# Altium project Adapter_NI_IP_L1.PrjPCB
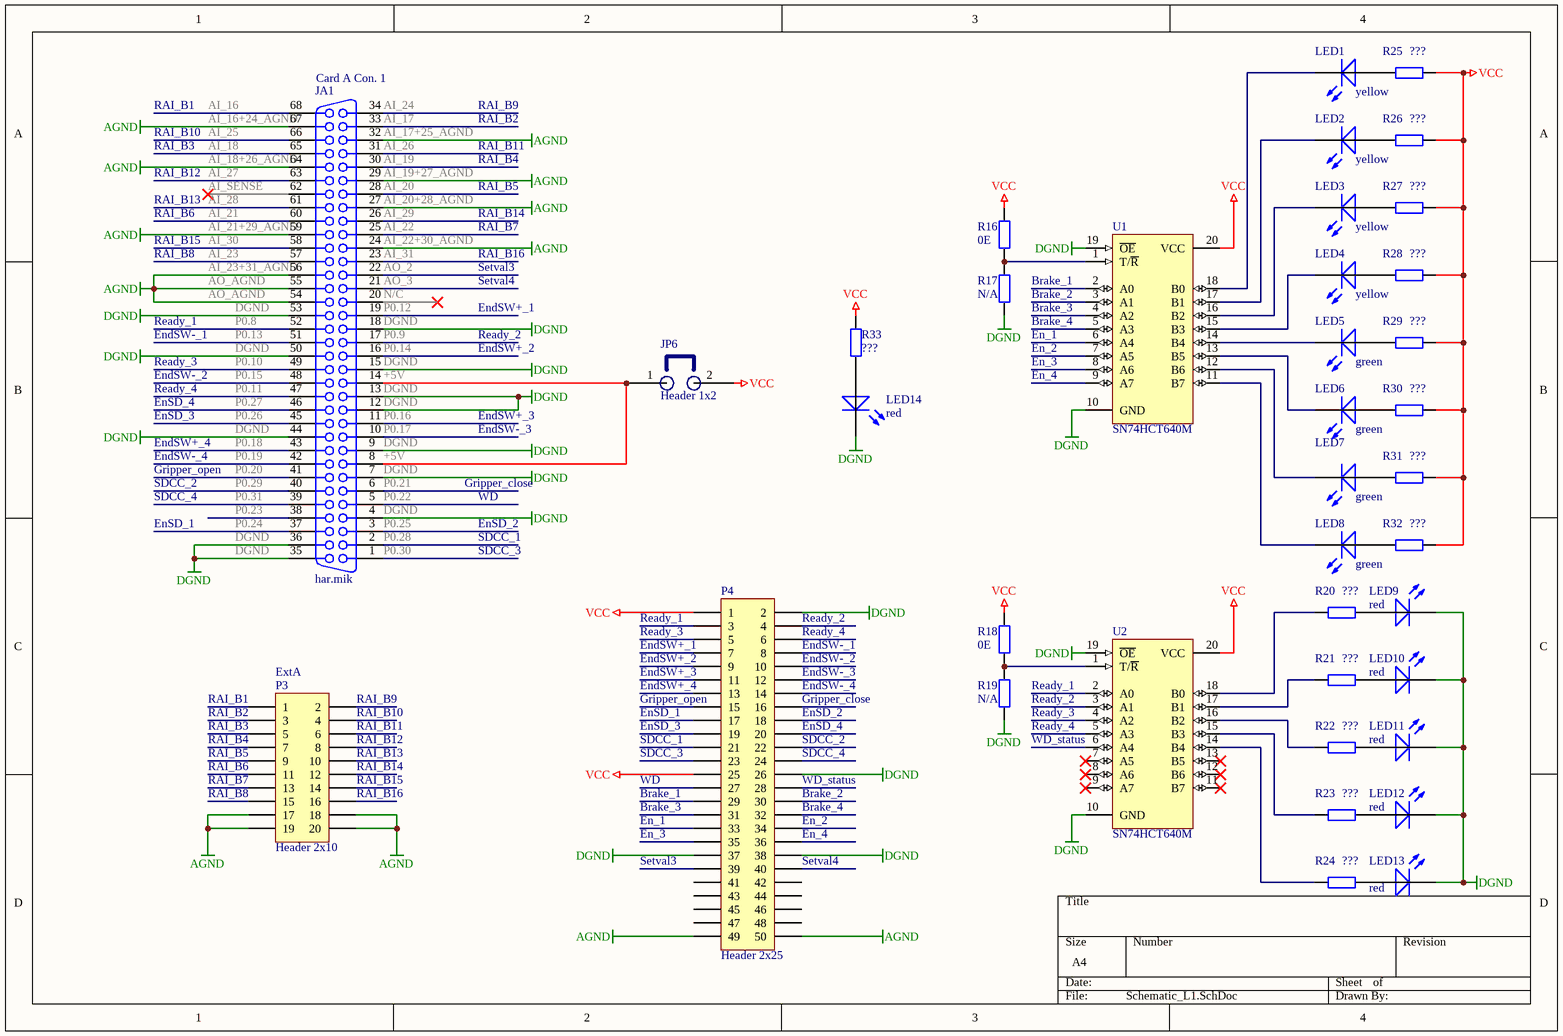
[diagram p0: Schematic_L1.SchDoc]
1 sheet, 38 parts. Net scope: global (net labels, ports and power ports of the same name join across sheets).
Board file: PCB_L1.PcbDoc

## Sheet Schematic_L1.SchDoc
size A4

### Parts
JA1  har.mik  [HAR-MIK P/S 68 SA]
JP6  Header 1x2  [Header - 1x2 - V]
LED1  yellow  [KM2520]
LED2  yellow  [KM2520]
LED3  yellow  [KM2520]
LED4  yellow  [KM2520]
LED5  green  [KM2520]
LED6  green  [KM2520]
LED7  green  [KM2520]
LED8  green  [KM2520]
LED9  red  [KM2520]
LED10  red  [KM2520]
LED11  red  [KM2520]
LED12  red  [KM2520]
LED13  red  [KM2520]
LED14  red  [KM2520]
P3  Header 2x10  [Header - 2x10 - V]
P4  Header 2x25  [Header - 2x25 - V]
R16  0E  [0805]
R17  N/A  [0805]
R18  0E  [0805]
R19  N/A  [0805]
R20  ???  [0805]
R21  ???  [0805]
R22  ???  [0805]
R23  ???  [0805]
R24  ???  [0805]
R25  ???  [0805]
R26  ???  [0805]
R27  ???  [0805]
R28  ???  [0805]
R29  ???  [0805]
R30  ???  [0805]
R31  ???  [0805]
R32  ???  [0805]
R33  ???  [0805]
U1  SN74HCT640M  [DW020_N]
U2  SN74HCT640M  [DW020_N]

### Nets
AGND: JA1.24 JA1.27 JA1.29 JA1.32 JA1.54 JA1.55 JA1.56 JA1.59 JA1.64 JA1.67 P3.17 P3.18 P3.19 P3.20 P4.49 P4.50
DGND: JA1.4 JA1.7 JA1.9 JA1.12 JA1.13 JA1.15 JA1.18 JA1.35 JA1.36 JA1.44 JA1.50 JA1.53 LED9.1(K) LED10.1(K) LED11.1(K) LED12.1(K) LED13.1(K) LED14.1(K) P4.2 P4.26 P4.37 P4.38 R17.1 R19.1 U1.10(GND) U1.19(~{OE}) U2.10(GND) U2.19(~{OE})
VCC: JP6.2 P4.1 P4.25 R16.2 R18.2 R25.2 R26.2 R27.2 R28.2 R29.2 R30.2 R31.2 R32.2 R33.2 U1.20(VCC) U2.20(VCC)
Brake_1: P4.29 U1.2(A0)
Brake_2: P4.30 U1.3(A1)
Brake_3: P4.31 U1.4(A2)
Brake_4: P4.32 U1.5(A3)
En_1: P4.33 U1.6(A4)
En_2: P4.34 U1.7(A5)
En_3: P4.35 U1.8(A6)
En_4: P4.36 U1.9(A7)
EndSW+_1: JA1.19 P4.7
EndSW+_2: JA1.16 P4.9
EndSW+_3: JA1.11 P4.11
EndSW+_4: JA1.43 P4.13
EndSW-_1: JA1.51 P4.8
EndSW-_2: JA1.48 P4.10
EndSW-_3: JA1.10 P4.12
EndSW-_4: JA1.42 P4.14
EnSD_1: JA1.37 P4.17
EnSD_2: JA1.3 P4.18
EnSD_3: JA1.45 P4.19
EnSD_4: JA1.46 P4.20
Gripper_close: JA1.6 P4.16
Gripper_open: JA1.41 P4.15
RAI_B1: JA1.68 P3.1
RAI_B2: JA1.33 P3.3
RAI_B3: JA1.65 P3.5
RAI_B4: JA1.30 P3.7
RAI_B5: JA1.28 P3.9
RAI_B6: JA1.60 P3.11
RAI_B7: JA1.25 P3.13
RAI_B8: JA1.57 P3.15
RAI_B9: JA1.34 P3.2
RAI_B10: JA1.66 P3.4
RAI_B11: JA1.31 P3.6
RAI_B12: JA1.63 P3.8
RAI_B13: JA1.61 P3.10
RAI_B14: JA1.26 P3.12
RAI_B15: JA1.58 P3.14
RAI_B16: JA1.23 P3.16
Ready_1: JA1.52 P4.3 U2.2(A0)
Ready_2: JA1.17 P4.4 U2.3(A1)
Ready_3: JA1.49 P4.5 U2.4(A2)
Ready_4: JA1.47 P4.6 U2.5(A3)
SDCC_1: JA1.2 P4.21
SDCC_2: JA1.40 P4.22
SDCC_3: JA1.1 P4.23
SDCC_4: JA1.39 P4.24
Setval3: JA1.22 P4.39
Setval4: JA1.21 P4.40
WD: JA1.5 P4.27
WD_status: P4.28 U2.6(A4)
NetJA1_8: JA1.8 JA1.14 JP6.1
NetLED1_1: LED1.1(K) U1.18(B0)
NetLED1_2: LED1.2(A) R25.1
NetLED2_1: LED2.1(K) U1.17(B1)
NetLED2_2: LED2.2(A) R26.1
NetLED3_1: LED3.1(K) U1.16(B2)
NetLED3_2: LED3.2(A) R27.1
NetLED4_1: LED4.1(K) U1.15(B3)
NetLED4_2: LED4.2(A) R28.1
NetLED5_1: LED5.1(K) U1.14(B4)
NetLED5_2: LED5.2(A) R29.1
NetLED6_1: LED6.1(K) U1.13(B5)
NetLED6_2: LED6.2(A) R30.1
NetLED7_1: LED7.1(K) U1.12(B6)
NetLED7_2: LED7.2(A) R31.1
NetLED8_1: LED8.1(K) U1.11(B7)
NetLED8_2: LED8.2(A) R32.1
NetLED9_2: LED9.2(A) R20.2
NetLED10_2: LED10.2(A) R21.2
NetLED11_2: LED11.2(A) R22.2
NetLED12_2: LED12.2(A) R23.2
NetLED13_2: LED13.2(A) R24.2
NetLED14_2: LED14.2(A) R33.1
NetR16_1: R16.1 R17.2 U1.1(T/~{R})
NetR18_1: R18.1 R19.2 U2.1(T/~{R})
NetR20_1: R20.1 U2.18(B0)
NetR21_1: R21.1 U2.17(B1)
NetR22_1: R22.1 U2.16(B2)
NetR23_1: R23.1 U2.15(B3)
NetR24_1: R24.1 U2.14(B4)

Not connected (* = marked no-connect by the designer): JA1 20* 38 62*; P4 41 42 43 44 45 46 47 48; U2 7(A5)* 8(A6)* 9(A7)* 11(B7)* 12(B6)* 13(B5)*

### Notes on the sheet
- AI_16
- (near JA1) Card A Con. 1
- (near JA1) AI_24
- AI_25
- AI_18
- AI_27
- (near JA1) AI_18+26_AGND
- (near JA1) AI_16+24_AGND
- (near JA1) AI_17
- (near JA1) AI_17+25_AGND
- (near JA1) AI_26
- (near JA1) AI_19
- (near JA1) AI_19+27_AGND
- AI_SENSE
- AI_28
- AI_21
- AI_30
- (near JA1) AI_21+29_AGND
- (near JA1) AI_20
- (near JA1) AI_20+28_AGND
- (near JA1) AI_29
- (near JA1) AI_22
- (near JA1) AI_22+30_AGND
- AI_23
- AO_AGND
- (near JA1) AI_23+31_AGND
- DGND
- (near JA1) N/C
- (near JA1) AI_31
- (near JA1) AO_2
- (near JA1) AO_3
- (near JA1) P0.12
- P0.8
- (near JA1) P0.13
- (near JA1) P0.10
- (near JA1) P0.15
- (near JA1) DGND
- (near JA1) P0.9
- (near JA1) P0.14
- (near JA1) +5V
- (near JA1) P0.11
- (near JA1) P0.27
- (near JA1) P0.26
- (near JA1) P0.18
- (near JA1) P0.16
- (near JA1) P0.17
- (near JA1) P0.19
- (near JA1) P0.20
- (near JA1) P0.29
- (near JA1) P0.31
- (near JA1) P0.23
- (near JA1) P0.21
- (near JA1) P0.22
- (near JA1) P0.24
- (near JA1) P0.25
- (near JA1) P0.28
- (near JA1) P0.30
- (near P3) ExtA

### Library data of the parts
JA1 = Connector 68: TB 60 01 068 5232; PackageDocument: B; Positions: 68; Published: 15-Jun-2001; LatestRevisionDate: 17-Jul-2002; LatestRevisionNote: Re-released for DXP Platform.; DatasheetDocument: 1-Oct-1983; PackageReference: 178240-8; Publisher: Altium Limited; Orientation: Right Angle
JP6 = Jumper
LED1-LED14 = LED: Typical LED
  LED1-LED4: Color: yellow
  LED5-LED8: Color: green
  LED9-LED14: Color: red
P3 = Header 2x10: Header, 10-Pin, Dual row; LatestRevisionDate: 17-Jul-2002; LatestRevisionNote: Re-released for DXP Platform.; Publisher: Altium Limited
P4 = Header 2x25: Header, 25-Pin, Dual row; LatestRevisionDate: 17-Jul-2002; LatestRevisionNote: Re-released for DXP Platform.; Publisher: Altium Limited
R16-R33 = R: Resistor; #Manufacturer: Generic Components; #Publisher: Dr. A. Heinzelmann; #Class: Passive; #Published: 2006-10-06; #ClassSub: Resistor
  R16 R18: Value: 0E
  R17 R19: Value: N/A
  R20-R33: Value: ???
U1 U2 = SN74HCT640DW: Octal Bus Transceiver with 3-State Outputs; ComponentAvailability: Obsolete; Published: 8-Jun-2000; LatestRevisionDate: 13-Apr-2006; LatestRevisionNote: IPC-7351 Footprint Added.; DatasheetVersion: Sep-1987; PackageVersion: Mar-2000; PackageReference: DW020; Publisher: Altium Limited; PackageDescription: 20-Pin Plastic Small Outline Integrated Circuit 1.27 mm Pitch; Code_JEDEC: MS-013; Code_IPC: SOIC127P1030-20; ComponentLink1Description: Manufacturer Link; ComponentLink1URL: http://www.ti.com/; ComponentLink2Description: URL Link1; ComponentLink2URL: http://focus.ti.com/docs/prod/folders/print/sn74hct640.html